# EAGLE schematic BaromBoard (EAGLE 6.3)
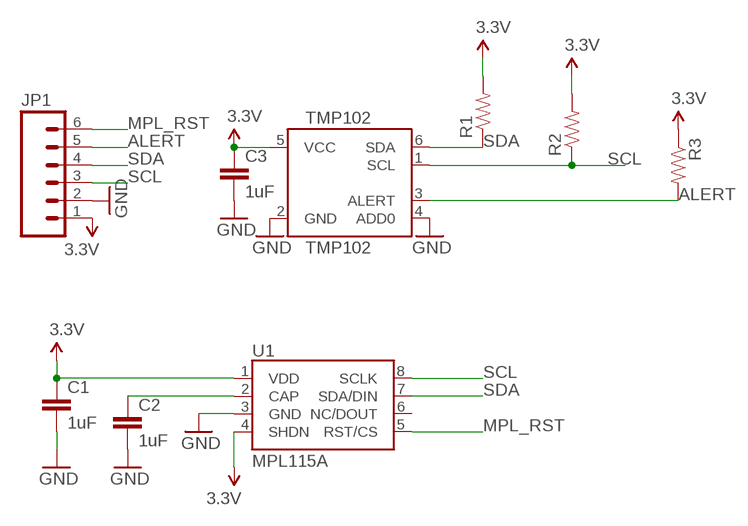
[diagram p0: schematic, sheet 1]

## Parts
C1  1uF  CAP0603-CAP  [0603-CAP]
C2  1uF  CAP0603-CAP  [0603-CAP]
C3  1uF  CAP0603-CAP  [0603-CAP]
JP1  M06SIP  [1X06]
R1  RESISTOR0603-RES  [0603-RES]
R2  RESISTOR0603-RES  [0603-RES]
R3  RESISTOR0603-RES  [0603-RES]
TMP102  TMP102  [SOT563]
U1  MPL115A  [LGA8]

## Nets
3.3V: C1.1 C3.1 JP1.1 R1.2 R2.2 R3.1 TMP102.5(VCC) U1.1(VDD) U1.4(SHDN)
ALERT: JP1.5 R3.2 TMP102.3(ALERT)
GND: C1.2 C2.2 C3.2 JP1.2 TMP102.2(GND) TMP102.4(ADD0) U1.3(GND)
MPL_RST: JP1.6 U1.5(RST/CS)
N$9: C2.1 U1.2(CAP)
SCL: JP1.3 R2.1 TMP102.1(SCL) U1.8(SCLK)
SDA: JP1.4 R1.1 TMP102.6(SDA) U1.7(SDA/DIN)
Unconnected: U1.6(NC/DOUT)

## Library data of the parts
C1-C3 = SparkFun-Passives:CAP: Capacitor Standard 0603 ceramic capacitor, and 0.1" leaded capacitor.
JP1 = SparkFun-Connectors:M06: Header 6 Standard 6-pin 0.1" header. Use with straight break away headers (SKU : PRT-00116), right angle break away headers (PRT-00553), swiss pins (PRT-00743), machine pins (PRT-00117), and female headers (PRT-00115). Molex polarized connector foot print use with SKU : PRT-08094 with associated crimp pins and housings. NOTES ON THE VARIANTS LOCK and LOCK_LONGPADS... This footprint was designed to help hold the alignment of a through-hole component (i.e. 6-pin header) while soldering it into place. You may notice that each hole has been shifted either up or down by 0.005 of an inch from it's more standard position (which is a perfectly straight line). This slight alteration caused the pins (the squares in the middle) to touch the edges of the holes. Because they are alternating, it causes a "brace" to hold the component in place. 0.005 has proven to be the perfect amount of "off-center" position when using our standard breakaway headers. Although looks a little odd when you look at the bare footprint, once you have a header in there, the alteration is very hard to notice. Also, if you push a header all the way into place, it is covered up entirely on the bottom side. This idea of altering the position of holes to aid alignment will be further integrated into the Sparkfun Library for other footprints. It can help hold any component with 3 or more connection pins.
R1-R3 = SparkFun-Passives:RESISTOR: Resistor Basic schematic elements and footprints for 0603, 1206, and PTH resistors.
TMP102 = SparkFun-Sensors:TMP102: I2C degC temp sensor
U1 = SparkFun-Sensors:MPL115A: MPL115A1 (SPI) and MPL115A2 (I2C) Miniature Digital Barometer 5.0x3.0x1.2mm LGA Package